# EasyEDA Pro project multi_port.eprj, schematic GL3520 US3.0集線器

## Sheets
1 main control: Board Name: Board1; Create Date: 2024-11-21; Page Name: main control; Project Name: multi_port; Schematic Name: GL3520 US3.0集線器; Update Date: 2025-04-09; Company: 嘉立创EDA; Page Size: A4; Version: V1.0
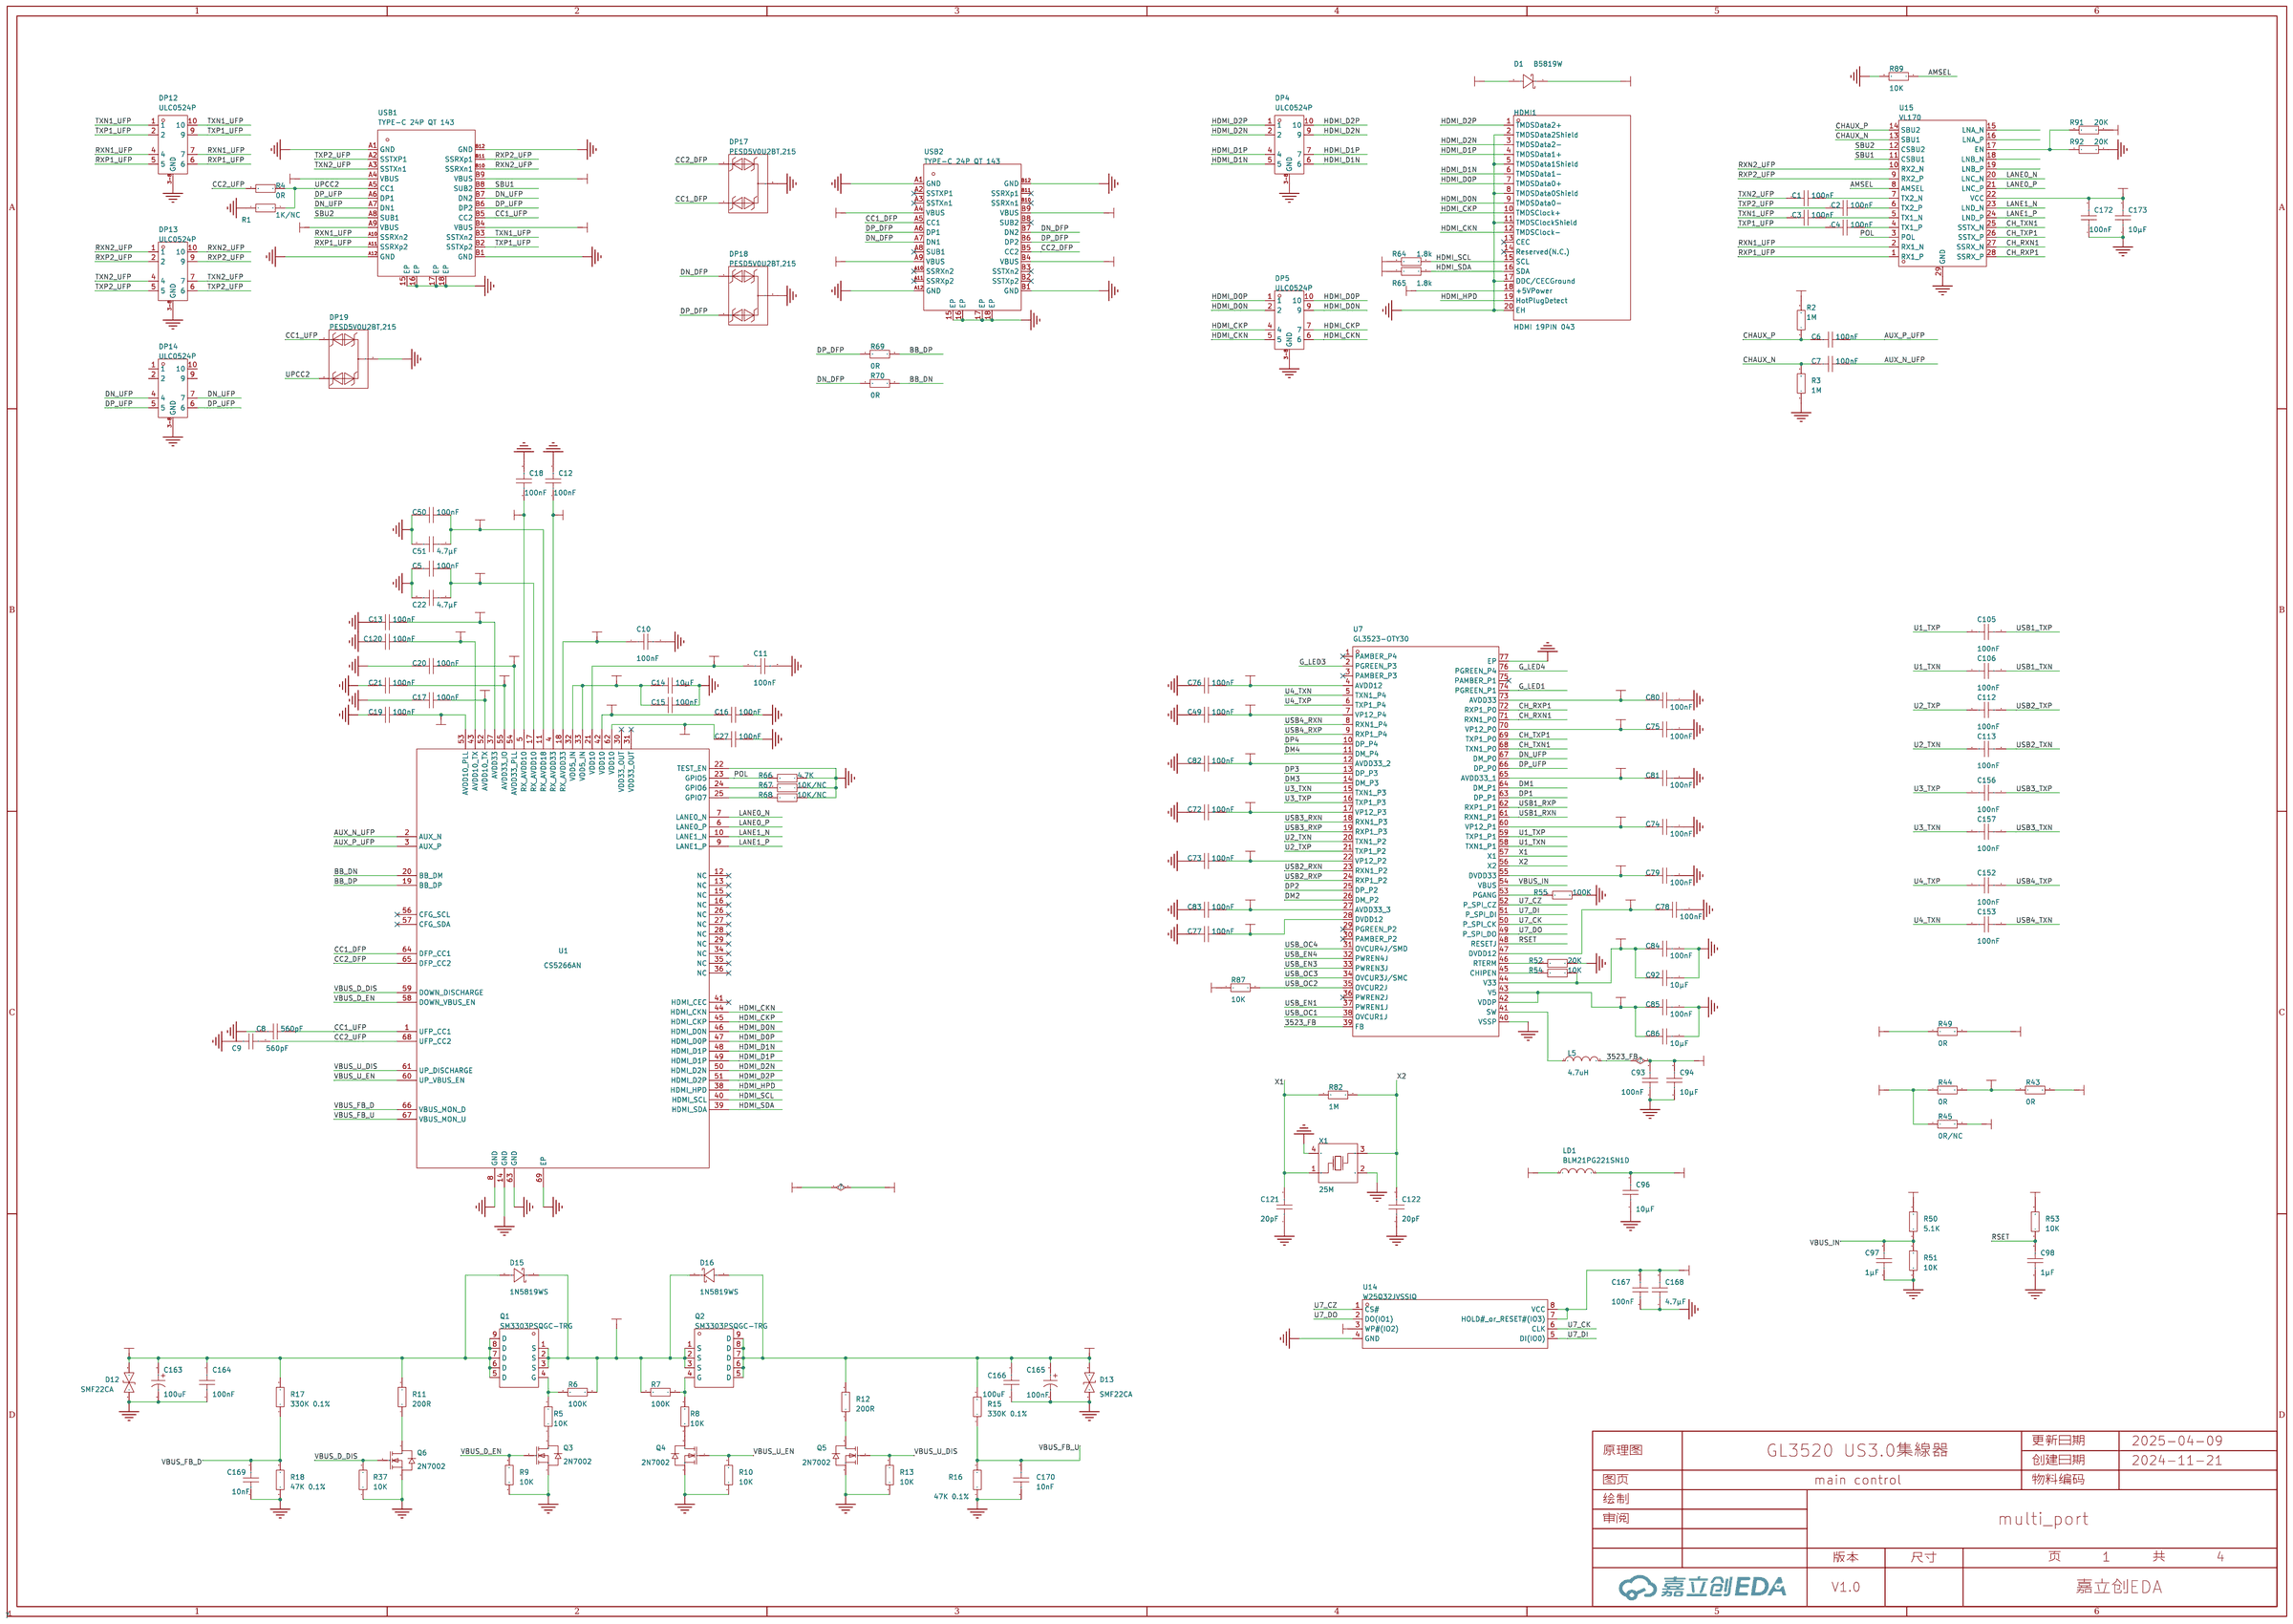
[diagram p0: main control]
2 Charging: Create Date: 2024-11-22; Page Name: Charging; Update Date: 2025-02-21
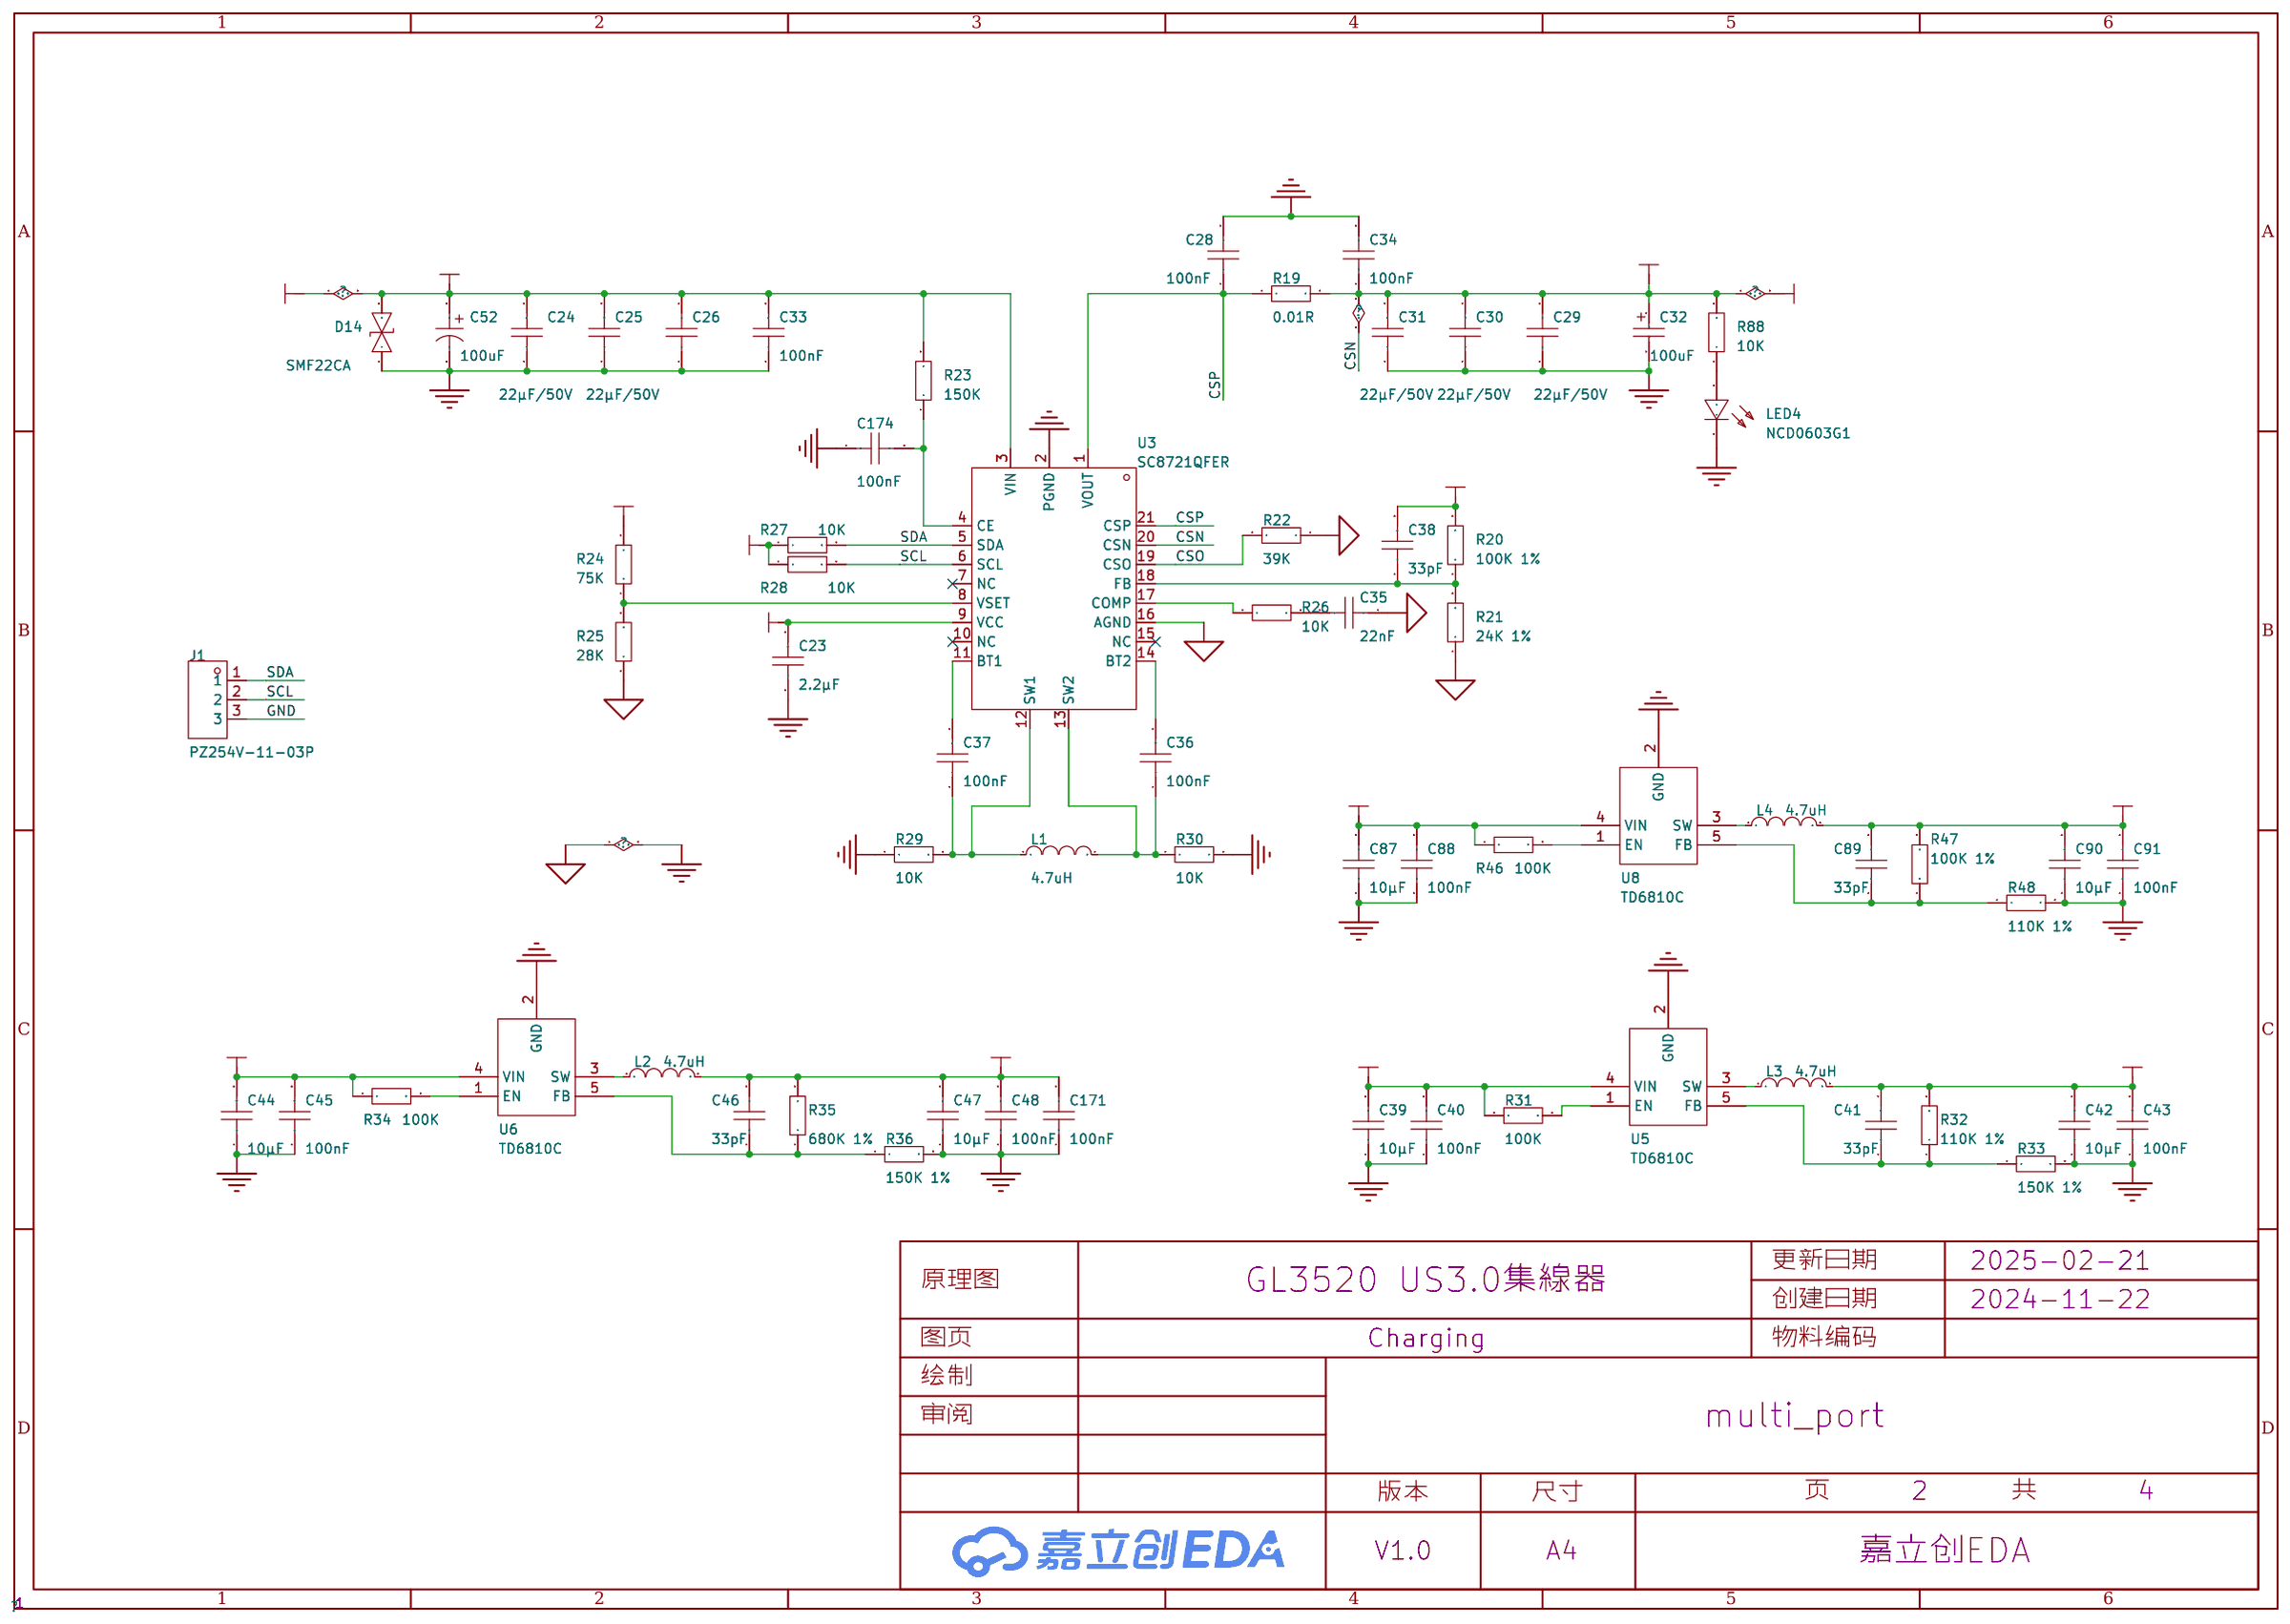
[diagram p1: Charging]
3 Port: Create Date: 2024-11-22; Page Name: Port; Update Date: 2025-02-20
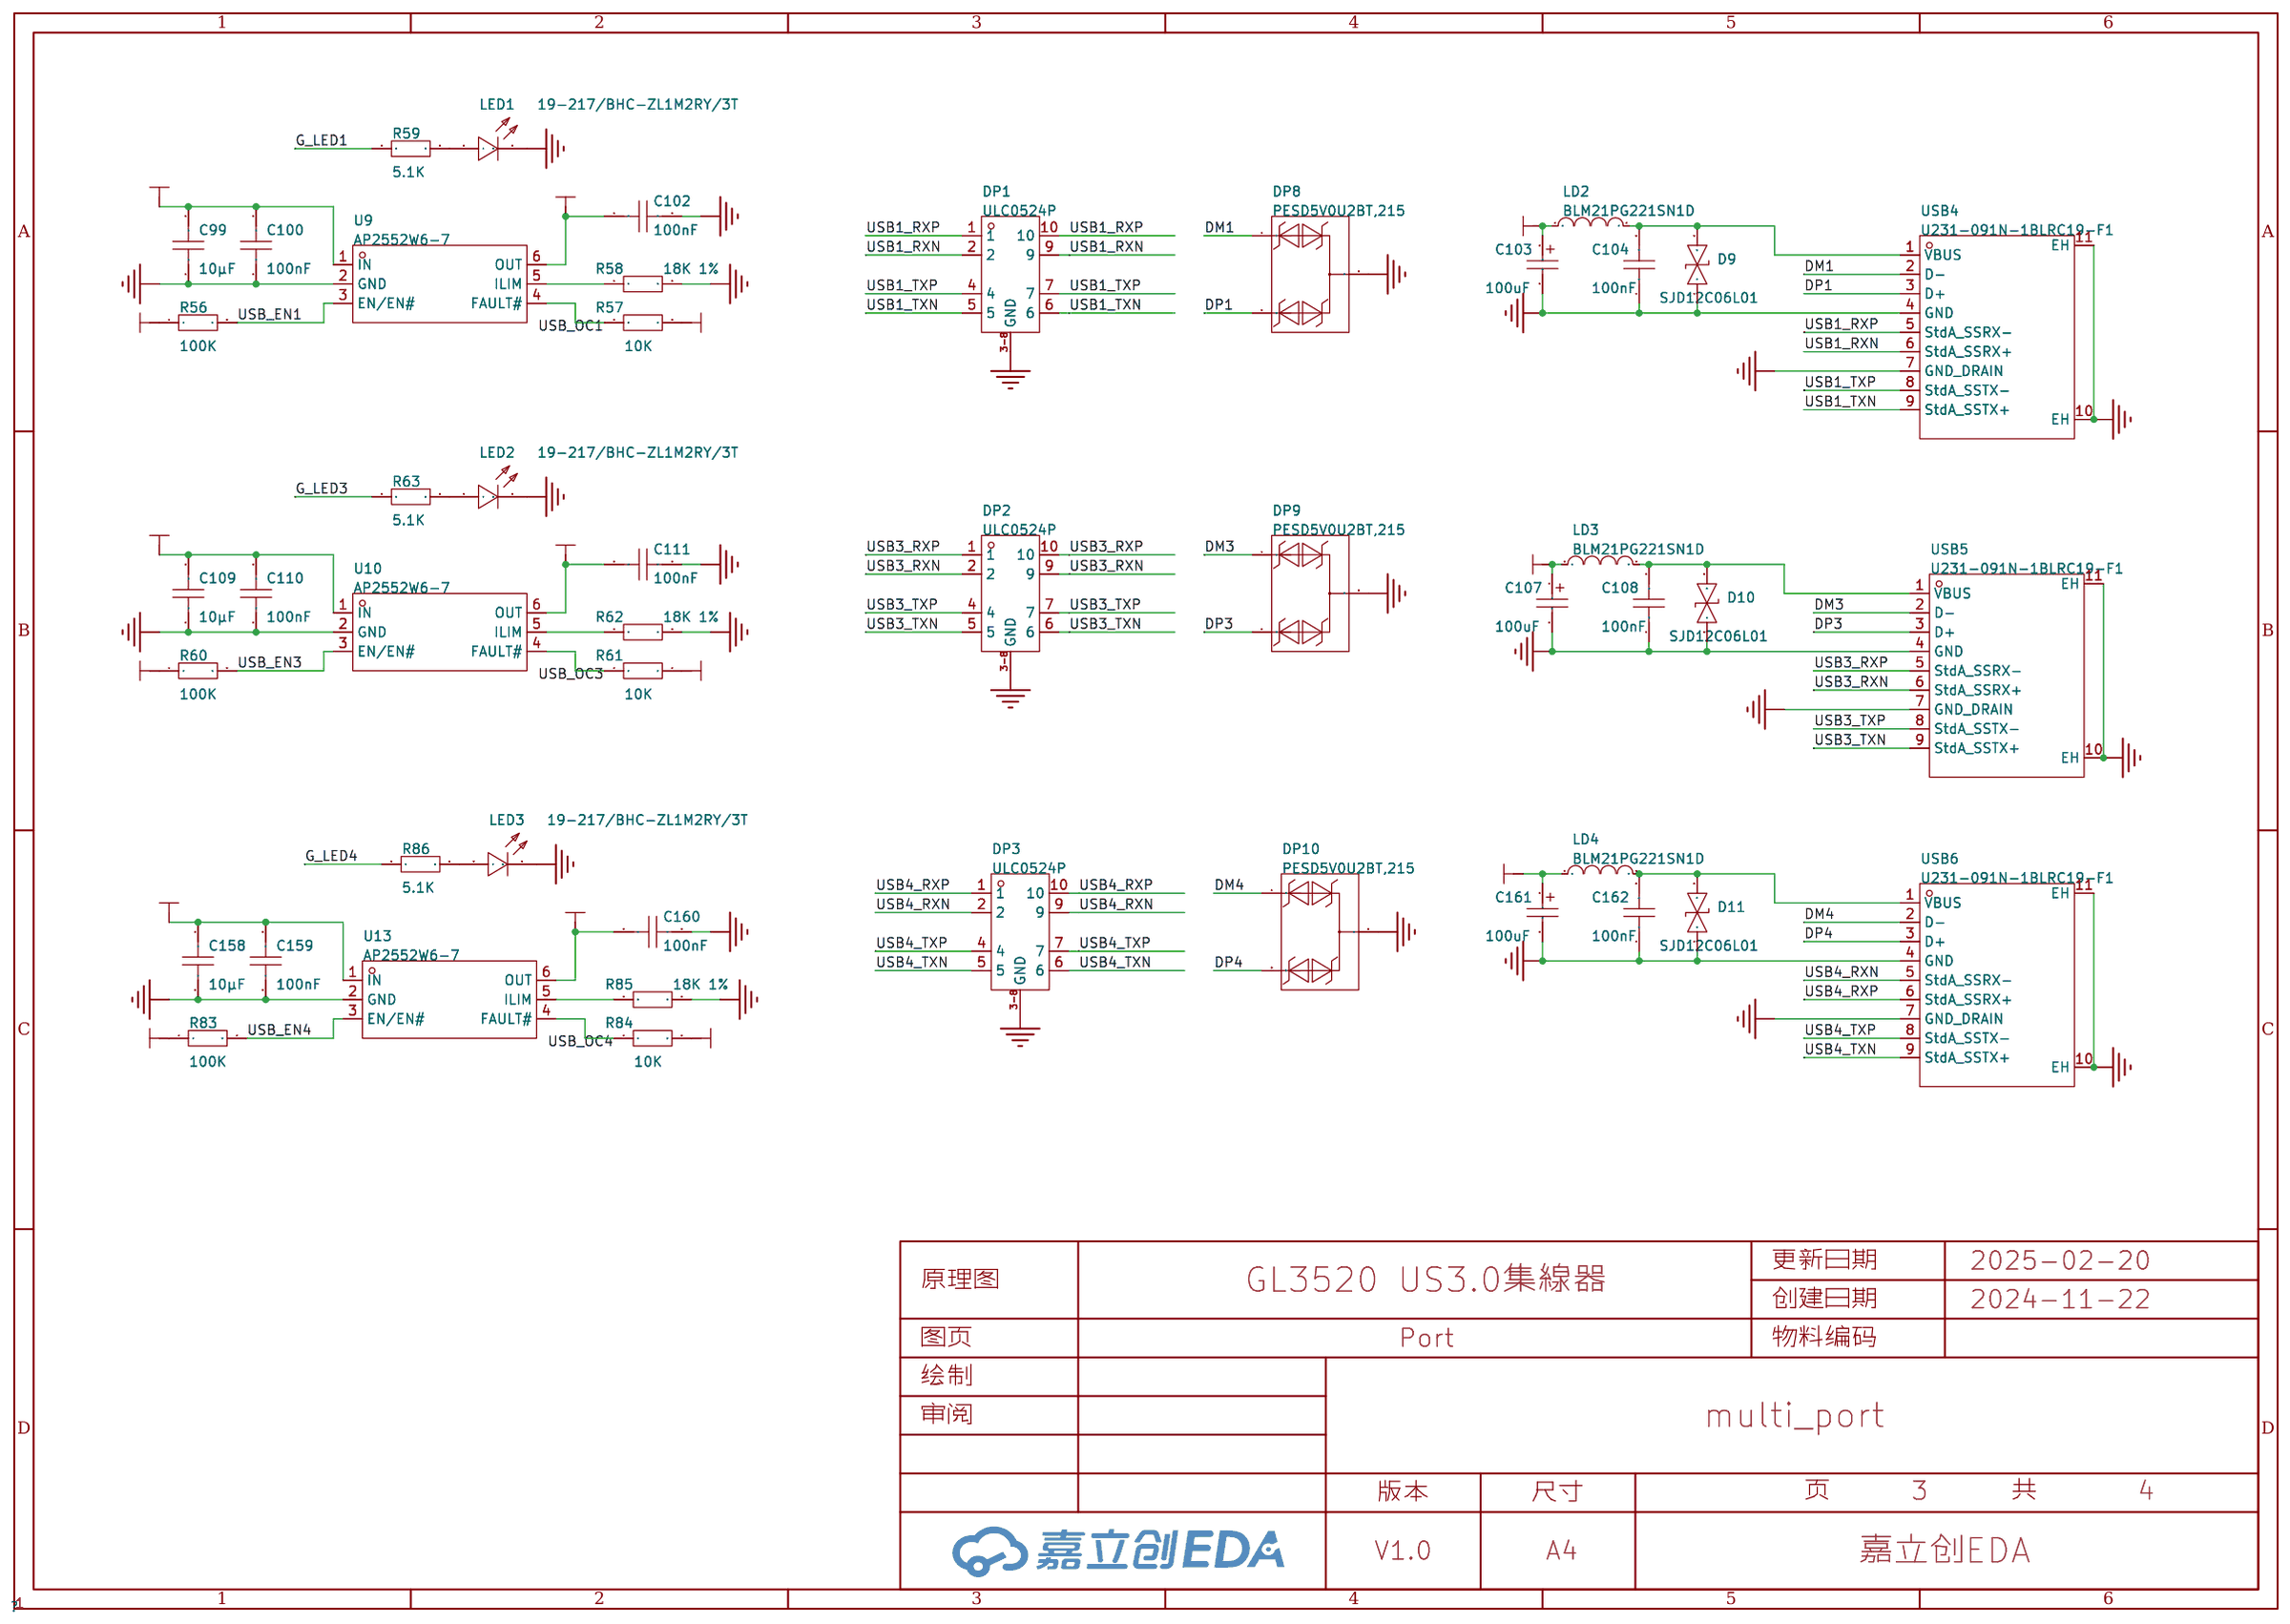
[diagram p2: Port]
4 Internet: Create Date: 2024-11-22; Page Name: Internet; Update Date: 2025-02-21
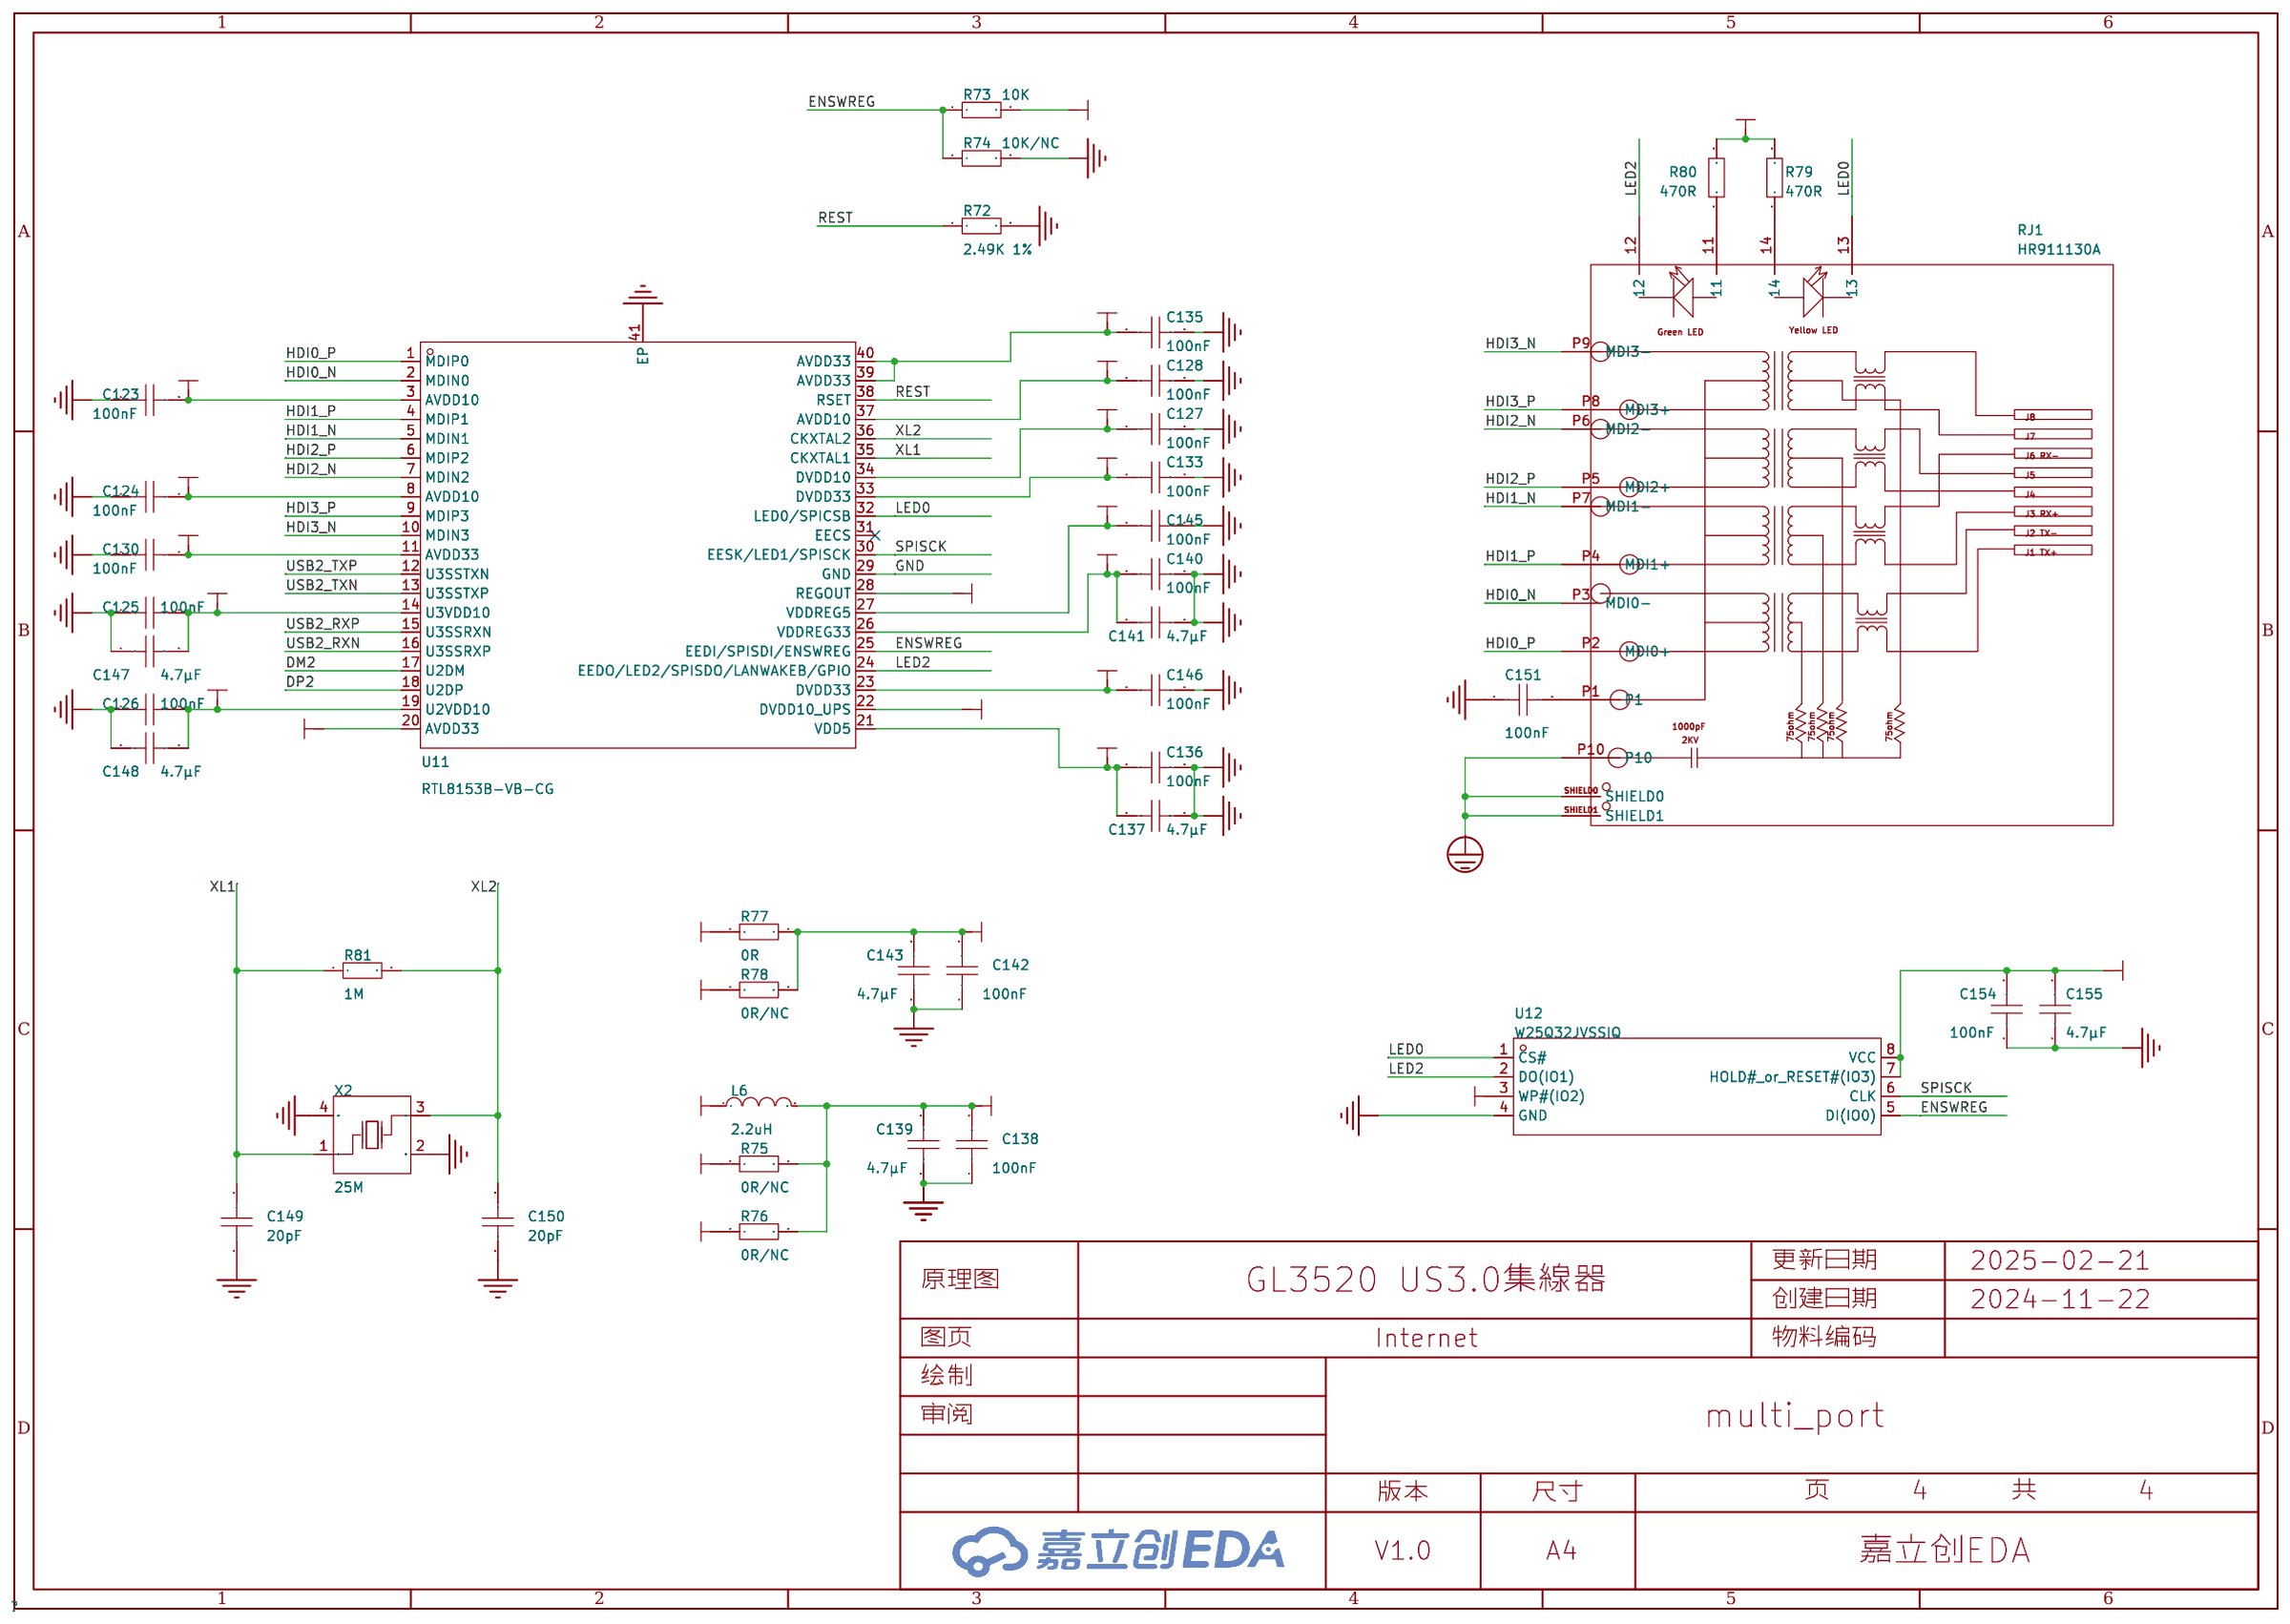
[diagram p3: Internet]

## Parts
sheet Charging
C23  2.2μF  [C0603]
C24  22μF/50V  [C0805]
C25  22μF/50V  [C0805]
C26  100nF  [C0805]
C28  100nF  [C0603]
C29  22μF/50V  [C0805]
C30  22μF/50V  [C0805]
C31  22μF/50V  [C0805]
C32  100uF  [CASE-B_3528]
C33  100nF  [C0603]
C34  100nF  [C0603]
C35  22nF  [C0603]
C36  100nF  [C0603]
C37  100nF  [C0603]
C38  33pF  [C0603]
C39  10μF  [C0603]
C40  100nF  [C0603]
C41  33pF  [C0603]
C42  10μF  [C0603]
C43  100nF  [C0603]
C44  10μF  [C0603]
C45  100nF  [C0603]
C46  33pF  [C0603]
C47  10μF  [C0603]
C48  100nF  [C0603]
C52  100uF  [CAP-TH_BD6.0-P2.50-D0.5-FD]
C87  10μF  [C0603]
C88  100nF  [C0603]
C89  33pF  [C0603]
C90  10μF  [C0603]
C91  100nF  [C0603]
C171  100nF  [C0603]
C174  100nF  [C0603]
D14  SMF22CA  [SOD-123FL_L2.8-W1.8-LS3.7-BI]
J1  PZ254V-11-03P  [HDR-TH_3P-P2.54-V-M]
L1  4.7uH  [IND-SMD_L7.3-W6.6]
L2  4.7uH  [IND-SMD_L4.0-W4.0]
L3  4.7uH  [IND-SMD_L4.0-W4.0]
L4  4.7uH  [IND-SMD_L4.0-W4.0]
LED4  NCD0603G1  [LED0603-RD_1]
R19  0.01R  [R1206]
R20  100K 1%  [R0603]
R21  24K 1%  [R0603]
R22  39K  [R0603]
R23  150K  [R0603]
R24  75K  [R0603]
R25  28K  [R0603]
R26  10K  [R0603]
R27  10K  [R0603]
R28  10K  [R0603]
R29  10K  [R0603]
R30  10K  [R0603]
R31  100K  [R0603]
R32  110K 1%  [R0603]
R33  150K 1%  [R0603]
R34  100K  [R0603]
R35  680K 1%  [R0603]
R36  150K 1%  [R0603]
R46  100K  [R0603]
R47  100K 1%  [R0603]
R48  110K 1%  [R0603]
R88  10K  [R0603]
U3  SC8721QFER  [QFN-21_L4.0-W4.0-P0.40-BL_SC8721QFER]
U5  TD6810C  [SOT-23-5_L3.0-W1.7-P0.95-LS2.8-BR]
U6  TD6810C  [SOT-23-5_L3.0-W1.7-P0.95-LS2.8-BR]
U8  TD6810C  [SOT-23-5_L3.0-W1.7-P0.95-LS2.8-BR]
sheet Internet
C123  100nF  [C0603]
C124  100nF  [C0603]
C125  100nF  [C0603]
C126  100nF  [C0603]
C127  100nF  [C0603]
C128  100nF  [C0603]
C130  100nF  [C0603]
C133  100nF  [C0603]
C135  100nF  [C0603]
C136  100nF  [C0603]
C137  4.7μF  [C0603]
C138  100nF  [C0603]
C139  4.7μF  [C0603]
C140  100nF  [C0603]
C141  4.7μF  [C0603]
C142  100nF  [C0603]
C143  4.7μF  [C0603]
C145  100nF  [C0603]
C146  100nF  [C0603]
C147  4.7μF  [C0603]
C148  4.7μF  [C0603]
C149  20pF  [C0603]
C150  20pF  [C0603]
C151  100nF  [C0603]
C154  100nF  [C0603]
C155  4.7μF  [C0603]
L6  2.2uH  [IND-SMD_L2.5-W2.0-VLS252012CX-150M]
R72  2.49K 1%  [R0603]
R73  10K  [R0603]
R74  10K/NC  [R0603]
R75  0R/NC  [R0805]
R76  0R/NC  [R0805]
R77  0R  [R0805]
R78  0R/NC  [R0805]
R79  470R  [R0603]
R80  470R  [R0603]
R81  1M  [R0603]
RJ1  HR911130A  [RJ45-TH_HR911130A]
U11  RTL8153B-VB-CG  [QFN-40_L5.0-W5.0-P0.40-BL-EP3.7]
U12  W25Q32JVSSIQ  [SOIC-8_L5.3-W5.3-P1.27-LS8.0-BL]
X2  25M  [CRYSTAL-SMD_4P-L2.0-W1.6-BL]
sheet main control
C1  100nF  [C0603]
C2  100nF  [C0603]
C3  100nF  [C0603]
C4  100nF  [C0603]
C5  100nF  [C0603]
C6  100nF  [C0603]
C7  100nF  [C0603]
C8  560pF  [C0603]
C9  560pF  [C0603]
C10  100nF  [C0603]
C11  100nF  [C0603]
C12  100nF  [C0603]
C13  100nF  [C0603]
C14  10μF  [C0603]
C15  100nF  [C0603]
C16  100nF  [C0603]
C17  100nF  [C0603]
C18  100nF  [C0603]
C19  100nF  [C0603]
C20  100nF  [C0603]
C21  100nF  [C0603]
C22  4.7μF  [C0603]
C27  100nF  [C0603]
C49  100nF  [C0603]
C50  100nF  [C0603]
C51  4.7μF  [C0603]
C72  100nF  [C0603]
C73  100nF  [C0603]
C74  100nF  [C0603]
C75  100nF  [C0603]
C76  100nF  [C0603]
C77  100nF  [C0603]
C78  100nF  [C0603]
C79  100nF  [C0603]
C80  100nF  [C0603]
C81  100nF  [C0603]
C82  100nF  [C0603]
C83  100nF  [C0603]
C84  100nF  [C0603]
C85  100nF  [C0603]
C86  10μF  [C0603]
C92  10μF  [C0603]
C93  100nF  [C0603]
C94  10μF  [C0603]
C96  10μF  [C0603]
C97  1μF  [C0603]
C98  1μF  [C0603]
C105  100nF  [C0603]
C106  100nF  [C0603]
C112  100nF  [C0603]
C113  100nF  [C0603]
C120  100nF  [C0603]
C121  20pF  [C0603]
C122  20pF  [C0603]
C152  100nF  [C0603]
C153  100nF  [C0603]
C156  100nF  [C0603]
C157  100nF  [C0603]
C163  100uF  [CAP-TH_BD6.3-P2.50-D1.0-FD]
C164  100nF  [C0603]
C165  100uF  [CAP-TH_BD6.3-P2.50-D1.0-FD]
C166  100nF  [C0603]
C167  100nF  [C0603]
C168  4.7μF  [C0603]
C169  10nF  [C0603]
C170  10nF  [C0603]
C172  100nF  [C0603]
C173  10μF  [C0603]
D1  B5819W  [SOD-123F_L2.7-W1.6-LS3.8-RD-1]
D12  SMF22CA  [SOD-123FL_L2.8-W1.8-LS3.7-BI]
D13  SMF22CA  [SOD-123FL_L2.8-W1.8-LS3.7-BI]
D15  1N5819WS  [SOD-323_L1.6-W1.3-LS2.6-RD-1]
D16  1N5819WS  [SOD-323_L1.6-W1.3-LS2.6-RD-1]
DP4  ULC0524P  [DSON-10_L2.5-W1.0-P0.50-BL]
DP5  ULC0524P  [DSON-10_L2.5-W1.0-P0.50-BL]
DP12  ULC0524P  [DSON-10_L2.5-W1.0-P0.50-BL]
DP13  ULC0524P  [DSON-10_L2.5-W1.0-P0.50-BL]
DP14  ULC0524P  [DSON-10_L2.5-W1.0-P0.50-BL]
DP17  PESD5V0U2BT,215  [SOT-23-3_L2.9-W1.6-P1.90-LS2.8-BR]
DP18  PESD5V0U2BT,215  [SOT-23-3_L2.9-W1.6-P1.90-LS2.8-BR]
DP19  PESD5V0U2BT,215  [SOT-23-3_L2.9-W1.6-P1.90-LS2.8-BR]
HDMI1  HDMI 19PIN 043  [HDMI-SMD_HDMI-19PIN-043]
L5  4.7uH  [IND-SMD_L4.0-W4.0]
LD1  BLM21PG221SN1D  [L0805]
Q1  SM3303PSQGC-TRG  [WDFN-8_L3.0-W3.0-P0.65-BL]
Q2  SM3303PSQGC-TRG  [WDFN-8_L3.0-W3.0-P0.65-BL]
Q3  2N7002  [SOT-23-3_L2.9-W1.3-P1.90-LS2.4-BR]
Q4  2N7002  [SOT-23-3_L2.9-W1.3-P1.90-LS2.4-BR]
Q5  2N7002  [SOT-23-3_L2.9-W1.3-P1.90-LS2.4-BR]
Q6  2N7002  [SOT-23-3_L2.9-W1.3-P1.90-LS2.4-BR]
R1  1K/NC  [R0603]
R2  1M  [R0603]
R3  1M  [R0603]
R4  0R  [R0603]
R5  10K  [R0603]
R6  100K  [R0603]
R7  100K  [R0603]
R8  10K  [R0603]
R9  10K  [R0603]
R10  10K  [R0603]
R11  200R  [R0805]
R12  200R  [R0805]
R13  10K  [R0603]
R15  330K 0.1%  [R0603]
R16  47K 0.1%  [R0603]
R17  330K 0.1%  [R0603]
R18  47K 0.1%  [R0603]
R37  10K  [R0603]
R43  0R  [R0805]
R44  0R  [R0805]
R45  0R/NC  [R0805]
R49  0R  [R0805]
R50  5.1K  [R0603]
R51  10K  [R0603]
R52  20K  [R0603]
R53  10K  [R0603]
R54  10K  [R0603]
R55  100K  [R0603]
R64  1.8k  [R0603]
R65  1.8k  [R0603]
R66  4.7K  [R0603]
R67  10K/NC  [R0603]
R68  10K/NC  [R0603]
R69  0R  [R0603]
R70  0R  [R0603]
R82  1M  [R0603]
R87  10K  [R0603]
R89  10K  [R0603]
R91  20K  [R0603]
R92  20K  [R0603]
U1  CS5266AN  [QFN-68_L8.0-W8.0-P0.40-TL-EP5.7]
U7  GL3523-OTY30  [QFN-76_L9.0-W9.0-P0.40-BL-EP]
U14  W25Q32JVSSIQ  [SOIC-8_L5.3-W5.3-P1.27-LS8.0-BL]
U15  VL170  [MQFN-28_L4.5-W3.5-P0.40-BL-EP]
USB1  TYPE-C 24P QT 143  [TYPE-C-SMD_C9900025773]
USB2  TYPE-C 24P QT 143  [TYPE-C-SMD_C9900025773]
X1  25M  [CRYSTAL-SMD_4P-L2.0-W1.6-BL]
sheet Port
C99  10μF  [C0603]
C100  100nF  [C0603]
C102  100nF  [C0603]
C103  100uF  [CASE-B_3528]
C104  100nF  [C0603]
C107  100uF  [CASE-B_3528]
C108  100nF  [C0603]
C109  10μF  [C0603]
C110  100nF  [C0603]
C111  100nF  [C0603]
C158  10μF  [C0603]
C159  100nF  [C0603]
C160  100nF  [C0603]
C161  100uF  [CASE-B_3528]
C162  100nF  [C0603]
D9  SJD12C06L01  [SOD-123_L2.8-W1.8-LS3.7-BI]
D10  SJD12C06L01  [SOD-123_L2.8-W1.8-LS3.7-BI]
D11  SJD12C06L01  [SOD-123_L2.8-W1.8-LS3.7-BI]
DP1  ULC0524P  [DSON-10_L2.5-W1.0-P0.50-BL]
DP2  ULC0524P  [DSON-10_L2.5-W1.0-P0.50-BL]
DP3  ULC0524P  [DSON-10_L2.5-W1.0-P0.50-BL]
DP8  PESD5V0U2BT,215  [SOT-23-3_L2.9-W1.6-P1.90-LS2.8-BR]
DP9  PESD5V0U2BT,215  [SOT-23-3_L2.9-W1.6-P1.90-LS2.8-BR]
DP10  PESD5V0U2BT,215  [SOT-23-3_L2.9-W1.6-P1.90-LS2.8-BR]
LD2  BLM21PG221SN1D  [L0805]
LD3  BLM21PG221SN1D  [L0805]
LD4  BLM21PG221SN1D  [L0805]
LED1  19-217/BHC-ZL1M2RY/3T  [LED0603-FD_BLUE]
LED2  19-217/BHC-ZL1M2RY/3T  [LED0603-FD_BLUE]
LED3  19-217/BHC-ZL1M2RY/3T  [LED0603-FD_BLUE]
R56  100K  [R0603]
R57  10K  [R0603]
R58  18K 1%  [R0603]
R59  5.1K  [R0603]
R60  100K  [R0603]
R61  10K  [R0603]
R62  18K 1%  [R0603]
R63  5.1K  [R0603]
R83  100K  [R0603]
R84  10K  [R0603]
R85  18K 1%  [R0603]
R86  5.1K  [R0603]
U9  AP2552W6-7  [SOT-26_L3.0-W1.6-P0.95-LS2.8-BL]
U10  AP2552W6-7  [SOT-26_L3.0-W1.6-P0.95-LS2.8-BL]
U13  AP2552W6-7  [SOT-26_L3.0-W1.6-P0.95-LS2.8-BL]
USB4  U231-091N-1BLRC19-F1  [USB-3.0-TH_XKB_U231-091N-1BLRC19-F1]
USB5  U231-091N-1BLRC19-F1  [USB-3.0-TH_XKB_U231-091N-1BLRC19-F1]
USB6  U231-091N-1BLRC19-F1  [USB-3.0-TH_XKB_U231-091N-1BLRC19-F1]

## Library data of the parts
C1-C25 C27-C31 C33-C51 C72-C94 C96-C100 C102 C104-C106 C108-C113 C120-C128 C130 C133 C135-C143 C145-C160 C162 C164 C166-C174 = CAP_0603: Supplier Footprint: 0603
C26 = CAP_0805: Supplier Footprint: 0805
C32 = TAJB107K006RNJ: LCSC Part Name: 100uF ±10% 6.3V; Supplier Part: C16133; Manufacturer: Kyocera AVX; Supplier Footprint: CASE-B-3528-21(mm); JLCPCB Part Class: Basic Part; Datasheet: https://atta.szlcsc.com/upload/public/pdf/source/20160107/1457707750344.pdf; Supplier: LCSC; Tolerance: ±10%; Rated Voltage: 6.3V; Equivalent Series Resistance(ESR): 1.7Ω@100kHz; Operating Temperature: -55℃~+125℃
C52 = 35V100uF CD288: LCSC Part Name: 100uF ±20% 35V; Supplier Part: C2960219; Manufacturer: HRK(鸿瑞凯电子); Supplier Footprint: 插件,D6.3xL7mm; JLCPCB Part Class: Extended Part; Datasheet: https://atta.szlcsc.com/upload/public/pdf/source/20220224/25376043BEABA817BBA4B7CAB7E6DE1E.pdf; Supplier: LCSC; Tolerance: ±20%; Rated Voltage: 35V; Lead Spacing: 2.5mm; φD: 6.3mm; L: 7mm; Operating Temperature: -40℃~+105℃
D12-D14 = SMF22CA_C353295: Supplier Part: C353295; Manufacturer: 晶导微电子; Supplier Footprint: SOD-123FL; JLCPCB Part Class: Extended Part; Datasheet: https://atta.szlcsc.com/upload/public/pdf/source/20201106/C438024_76561727B84E8C9F41A4B4461A8AA838.pdf; Supplier: LCSC; Reverse Stand-Off Voltage (Vrwm): 22V; Maximum Clamping Voltage: 35.5V; Peak Pulse Current (Ipp)@10/1000us: 5.6A; Breakdown Voltage: 24.4V; Reverse Leakage Current (Ir): 1uA; Type: TVS
J1 = PZ254V-11-03P: LCSC Part Name: 间距:2.54mm 1x3P 直插 方针; Supplier Part: C2937625; Manufacturer: XFCN(兴飞); Supplier Footprint: 插件,P=2.54mm; JLCPCB Part Class: 扩展库; Datasheet: https://atta.szlcsc.com/upload/public/pdf/source/20200309/C492402_8335C3D49C4E4C618838D59BB1D024C1.pdf; Supplier: LCSC; Pin Structure: 1x3P; Pitch: 2.54mm; Circluar Pins/Square Pins: 方针; Mounting Type: 直插; Number of Rows: 单排; Number of Pins: 3P; Current Rating (Max): 3A; Voltage Rating (Max): 250V; Length of Mating Pin: 6mm; Insulation Height: 2.5mm; Length of End Connection Pin: 3mm; Operating Temperature Range: -40℃~+105℃; Color: 黑色
L1 = GSSM06304R7M2AU: LCSC Part Name: 4.7uH ±20% 10A; Supplier Part: C2928306; Manufacturer: ABC(千如); Supplier Footprint: SMD,6.6x7.3mm; JLCPCB Part Class: Extended Part; Datasheet: https://atta.szlcsc.com/upload/public/pdf/source/20211208/D33E2A1589C7A5FA690CD07A57271819.pdf; Supplier: LCSC; Tolerance: ±20%; Rated Current: 10A; Saturation Current (Isat): 10A; DC Resistance (DCR): 37mΩ
L2-L5 = SWPA4030S4R7MT: LCSC Part Name: 4.7uH ±20% 3.2A; Supplier Part: C57269; Manufacturer: Sunlord(顺络); Supplier Footprint: SMD,4x4mm; JLCPCB Part Class: Extended Part; Datasheet: https://atta.szlcsc.com/upload/public/pdf/source/20231024/317626D2AA2F8AB4113C1875E432E6E1.pdf; Supplier: LCSC; Tolerance: ±20%; Rated Current: 2A; Saturation Current (Isat): 3.2A; DC Resistance (DCR): 78mΩ
LED4 = NCD0603G1: Supplier Part: C84267; Manufacturer: 国星光电; Supplier Footprint: 0603; Datasheet: https://atta.szlcsc.com/upload/public/pdf/source/20200820/C84267_04BA7703640BAC111D09F5EFB971FBF3.pdf; Supplier: LCSC; Emitted Color: 翠绿色; Forward Voltage (VF): 2.6V~3.6V; Power Dissipation: 72mW; Forward Current: 10mA; Dominant Wavelength: 515nm~530nm; Lens Color: 无色透明透镜; Luminous Intensity: 330mcd~900mcd; Viewing Angle: 130°; Operating Temperature: -30℃~+85℃
R1-R10 R12 R13 R15-R17 R19-R37 R45-R70 R72-R89 R91 R92 = Res_0603: Supplier Footprint: 0603
U3 = SC8721QFER: Supplier Part: C429907; Manufacturer: SOUTHCHIP(南芯); Supplier Footprint: QFN-21(4x4); JLCPCB Part Class: 扩展库; Datasheet: https://atta.szlcsc.com/upload/public/pdf/source/20190920/C429907_D6CD4B988C6DA1964AADC51C5C4E505F.pdf; Supplier: LCSC
U5 U6 U8 = TD6810C: 功能类型:降压型;输入电压:2.5V~6.5V;输出电流:1.5A;; LCSC Part Name: DC-DC芯片; Supplier Part: C1884587; Manufacturer: Techcode(泰德); Supplier Footprint: SOT-23-5; JLCPCB Part Class: 扩展库; Datasheet: https://atta.szlcsc.com/upload/public/pdf/source/20210104/C1884587_758614A07123AB5D7D481634B0653658.pdf; Supplier: LCSC; Function: 降压型; Input Voltage: 2.5V~6.5V; Output Current: 1.5A; Switching Frequency: 1.5MHz; Operating Temperature: -40℃~+85℃; Synchronous Rectification: 是; Number of Outputs: 1; Switch tube (built-in/external): 内置
L6 = VLS252012CX-2R2M: LCSC Part Name: 2.2uH ±20% 停产; Supplier Part: C307867; Manufacturer: TDK; Supplier Footprint: 2520; JLCPCB Part Class: Extended Part; Datasheet: https://atta.szlcsc.com/upload/public/pdf/source/20200727/C307867_825634F56BDB10F5BF665C183AF56530.pdf; Supplier: LCSC; Tolerance: ±20%; Rated Current: 1.76A; DC Resistance (DCR): 80mΩ
RJ1 = HR911130A: LCSC Part Name: 带LED; Supplier Part: C54408; Manufacturer: HANRUN(汉仁); Supplier Footprint: 插件; Datasheet: https://atta.szlcsc.com/upload/public/pdf/source/20151014/1457707458393.pdf; Supplier: LCSC; Connector Type: RJ45插座; Number of Ports: 1; LED: 带LED
U11 = RTL8153B-VB-CG: LCSC Part Name: 适用于USB 3.0 集成10/100/1000M以太网控制器; Supplier Part: C2802072; Manufacturer: REALTEK(瑞昱); Supplier Footprint: QFN-40-EP(5x5); Datasheet: https://atta.szlcsc.com/upload/public/pdf/source/20220614/B5E31E0CB1F66CB9DAE335D144E02EAB.pdf; Supplier: LCSC
U12 U14 = W25Q32JVSSIQ: Supplier Part: C179173; Manufacturer: WINBOND(华邦); Supplier Footprint: SOIC-8-208mil; Datasheet: https://atta.szlcsc.com/upload/public/pdf/source/20191218/C179173_5BBD793D2D7B3672E140BC7AE85C11FF.pdf; Supplier: LCSC
X1 X2 = NX2016SA-25MHZ-STD-CZS-2: LCSC Part Name: NX2016SA 25MHz 8pF ±15ppm; Supplier Part: C843258; Manufacturer: NDK; Supplier Footprint: SMD2016-4P; JLCPCB Part Class: Extended Part; Datasheet: https://atta.szlcsc.com/upload/public/pdf/source/20201009/C843258_4E8DF2193DBAD12E5B49025E564DBC2F.pdf; Supplier: LCSC
C163 C165 = GR107M050E12RR0VH4FP0: LCSC Part Name: 100uF ±20% 50V 黑; Supplier Part: C47891; Manufacturer: CX(承兴); Supplier Footprint: 插件,D6.3xL12mm; JLCPCB Part Class: Extended Part; Datasheet: https://atta.szlcsc.com/upload/public/pdf/source/20211027/ED0DA65C69F42D9BDEC91091BA4C03CD.pdf; Supplier: LCSC; Tolerance: ±20%; Rated Voltage: 50V; Lead Spacing: 2.5mm; φD: 6.3mm; L: 12mm; Lifetime @ Temp: 2000hrs@105℃; Operating Temperature: -40℃~+105℃
D1 = B5819W: LCSC Part Name: 电压:40V 电流:1A; Supplier Part: C2943878; Manufacturer: GOODWORK(固得沃克); Supplier Footprint: SOD-123; JLCPCB Part Class: 扩展库; Datasheet: https://atta.szlcsc.com/upload/public/pdf/source/20220114/81042131F39C8520B6390246D7392C1A.pdf; Supplier: LCSC; Forward Voltage (Vf@If): 580mV@1A; Reverse Voltage (Vr): 40V; Average Rectified Current (Io): 1A; Reverse Leakage Current (Ir): 50uA@40V
D15 D16 = 1N5819WS: LCSC Part Name: 电压:40V 电流:1A; Supplier Part: C2903903; Manufacturer: GOODWORK(固得沃克); Supplier Footprint: SOD-323; JLCPCB Part Class: 扩展库; Datasheet: https://atta.szlcsc.com/upload/public/pdf/source/20220114/BF6ECC8ED918A91A4FEA6F25B6F03A5F.pdf; Supplier: LCSC; Forward Voltage (Vf@If): 580mV@1A; Reverse Voltage (Vr): 40V; Rectified Current: 1A; Reverse Leakage Current (Ir): 50uA@40V
DP1-DP5 DP12-DP14 = ULC0524P: 反向截止电压(Vrwm):5V;最大钳位电压:25V;峰值脉冲电流(Ipp)@10/1000us:5A;击穿电压:6V;; LCSC Part Name: TVS 5V截止 5A峰值脉冲; Supplier Part: C384892; Manufacturer: Leiditech(雷卯电子); Supplier Footprint: DSON-10; JLCPCB Part Class: 扩展库; Datasheet: https://atta.szlcsc.com/upload/public/pdf/source/20190425/C384892_9FA48074B6253F888578BF1973A5C10A.pdf; Supplier: LCSC; Reverse Stand-Off Voltage (Vrwm): 5V; Maximum Clamping Voltage: 25V; Peak Pulse Current (Ipp)@10/1000us: 5A; Breakdown Voltage: 6V; Type: TVS
DP8-DP10 DP17-DP19 = PESD5V0U2BT,215: 极性:双向;反向截止电压(Vrwm):5V;击穿电压:5.5V;; LCSC Part Name: 双向ESD; Supplier Part: C85399; Manufacturer: Nexperia(安世); Supplier Footprint: SOT-23; JLCPCB Part Class: 扩展库; Datasheet: https://atta.szlcsc.com/upload/public/pdf/source/20171113/C85399_15105616491421116133.pdf; Supplier: LCSC; polarity: 双向; Reverse Stand-Off Voltage (Vrwm): 5V; Breakdown Voltage: 5.5V; Number of Lines: 双路; Operating Temperature: -65℃~+150℃@(Ta); Type: ESD
HDMI1 = HDMI 19PIN 043: Supplier Part: C2858275; Manufacturer: SHOU HAN(首韩); Supplier Footprint: SMD; Datasheet: https://atta.szlcsc.com/upload/public/pdf/source/20210728/C2858275_DF299413048A9CF092C2A61AB97004F4.pdf; Supplier: LCSC
LD1-LD4 = BLM21PG221SN1D: LCSC Part Name: 单路 0805磁珠 阻抗220Ω@100MHz; Supplier Part: C85840; Manufacturer: muRata(村田); Supplier Footprint: 0805; JLCPCB Part Class: 扩展库; Datasheet: https://atta.szlcsc.com/upload/public/pdf/source/20180326/C118443_3FAC30E9A4F0E6B81275543C61E0685E.pdf; Supplier: LCSC; Impedance @ Frequency: 220Ω@100MHz; Tolerance: ±25%; DC Resistance: 45mΩ; Current Rating: 2A; Circuits: 1
Q1 Q2 = SM3303PSQGC-TRG: LCSC Part Name: 1个P沟道 耐压:30V 电流:50A; Supplier Part: C207600; Manufacturer: Sinopower(大中); Supplier Footprint: WDFN-8(3x3); JLCPCB Part Class: 扩展库; Datasheet: https://atta.szlcsc.com/upload/public/pdf/source/20200623/C207600_BE008E5BDECBD06E88D6264FAEA4868D.pdf; Supplier: LCSC; Type: 1个P沟道; Drain Source Voltage (Vdss): 30V; Continuous Drain Current (Id): 50A; Power Dissipation (Pd): 35.7W; Drain Source On Resistance (RDS(on)@Vgs,Id): 7.5mΩ@10V,17.1A; Gate Threshold Voltage (Vgs(th)@Id): 1.8V@250uA; Total Gate Charge (Qg@Vgs): 45nC@10V; Input Capacitance (Ciss@Vds): 2.11nF@15V; Reverse Transfer Capacitance (Crss@Vds): 330pF@15V
Q3-Q6 = 2N7002: LCSC Part Name: 1个N沟道 耐压:60V 电流:115mA; Supplier Part: C727149; Manufacturer: TWGMC(台湾迪嘉); Supplier Footprint: SOT-23; JLCPCB Part Class: 扩展库; Datasheet: https://atta.szlcsc.com/upload/public/pdf/source/20200827/C727149_F88DE2A79720D5B1ACE833184507B038.pdf; Supplier: LCSC; Type: 1个N沟道; Drain Source Voltage (Vdss): 60V; Continuous Drain Current (Id): 115mA; Drain Source On Resistance (RDS(on)@Vgs,Id): 7.5Ω@10V,500mA; Power Dissipation (Pd): 200mW; Gate Threshold Voltage (Vgs(th)@Id): 2.5V@250uA; Input Capacitance (Ciss@Vds): 50pF@25V; Reverse Transfer Capacitance (Crss@Vds): 5pF@25V; Operating Temperature: -55℃~+150℃
R11 R18 = Res_AXIAL-1/8W: Supplier Footprint: 轴向引线
R43 R44 = Res_0805: Supplier Footprint: 0805
U1 = CS5266AN: Supplier Part: C9900040338; Supplier Footprint: QFN-68_8X8; JLCPCB Part Class: 扩展库; Supplier: LCSC
U7 = GL3523-OTY30: 应用功能:-;接口协议:-;; Supplier Part: C390630; Manufacturer: GENESYS(创惟); Supplier Footprint: QFN-76-EP(9x9); JLCPCB Part Class: 扩展库; Datasheet: https://atta.szlcsc.com/upload/public/pdf/source/20190529/C390630_BF19E681E45EDC73D3FAA05E275250BB.pdf; Supplier: LCSC
U15 = VL170: Supplier Part: C2940040; Supplier Footprint: MQFN-28-EP(3.5x4.5); JLCPCB Part Class: 扩展库; Supplier: LCSC
USB1 USB2 = TYPE-C 24P QT 143: 连接器类型:Type-C;标准:USB 3.1;公母:母;安装方式:卧贴;触点数量:24P;端口数量:1;额定电流 - 电源:5A;触头材质:-;触头镀层:-;工作温度范围:-30℃~+85℃;焊接温度(最大值):-;; LCSC Part Name: Type-C 母 卧贴; Supplier Part: C5156605; Manufacturer: SHOU HAN(首韩); Supplier Footprint: SMD; JLCPCB Part Class: 扩展库; Datasheet: https://atta.szlcsc.com/upload/public/pdf/source/20220831/D9AE5CFF2AD0EFBF4D20F10BBA9527F7.pdf; Supplier: LCSC; Connector Type: Type-C; Standard: USB 3.1; Gender: 母; Mounting Style: 卧贴; Number of Contacts: 24P; Number of Ports: 1; Current Rating - Power (Max): 5A; Operating Temperature Range: -30℃~+85℃; Connect-Disconnect Life: 1万次; Core Colour: 黑色
C103 C107 C161 = TAJB107M010RNJ: LCSC Part Name: 100uF ±20% 10V; Supplier Part: C7196; Manufacturer: Kyocera AVX; Supplier Footprint: CASE-B-3528; JLCPCB Part Class: Extended Part; Datasheet: https://atta.szlcsc.com/upload/public/pdf/source/20160107/1457707750344.pdf; Supplier: LCSC; Tolerance: ±20%; Rated Voltage: 10V; Equivalent Series Resistance(ESR): 1.4Ω@100kHz; Operating Temperature: -55℃~+125℃
D9-D11 = SJD12C06L01: LCSC Part Name: 双向ESD; Supplier Part: C313261; Manufacturer: Brightking(君耀电子); Supplier Footprint: SOD-123S; Datasheet: https://atta.szlcsc.com/upload/public/pdf/source/20190308/C313298_C5F5DA7B871929800C41255070D52D63.pdf; Supplier: LCSC; polarity: 双向; Reverse Stand-Off Voltage (Vrwm): 6V; Maximum Clamping Voltage: 10.3V; Peak Pulse Current (Ipp)@10/1000us: 19.4A; Breakdown Voltage: 6.67V; Type: ESD
LED1-LED3 = 19-217/BHC-ZL1M2RY/3T: LCSC Part Name: 蓝灯 停产; Supplier Part: C72041; Manufacturer: EVERLIGHT(亿光); Supplier Footprint: 0603; Datasheet: https://atta.szlcsc.com/upload/public/pdf/source/20170116/1484561237273.pdf; Supplier: LCSC; Emitted Color: 蓝色; Power Dissipation: 110mW; Forward Current: 5mA; Dominant Wavelength: 465nm~475nm; Peak Wavelength: 468nm; Lens Color: 无色透明透镜; Viewing Angle: 120°; Operating Temperature: -40℃~+85℃
U9 U10 U13 = AP2552W6-7: Supplier Part: C441824; Manufacturer: DIODES(美台); Supplier Footprint: SOT-26; Datasheet: https://atta.szlcsc.com/upload/public/pdf/source/20191127/C460354_4CFAF7D8FFF7BAFA7FC0211C66DD32F3.pdf; Supplier: LCSC; Number of Outputs: 1; Output Current: 2.1A; Input Voltage: 2.7V~5.5V; Resistor On-State: 70mΩ; Operating Temperature	-: -40℃~+125℃
USB4-USB6 = U231-091N-1BLRC19-F1: LCSC Part Name: Type-A 母; Supplier Part: C2880601; Manufacturer: XKB Connection(中国星坤); Supplier Footprint: 插件; JLCPCB Part Class: 扩展库; Datasheet: https://atta.szlcsc.com/upload/public/pdf/source/20211011/F9152B67DDACB3260630B500156A0B45.pdf; Supplier: LCSC; Connector Type: Type-A; Gender: 母; Number of Contacts: 9P; Number of Ports: 1; Current Rating - Power (Max): 1.8A; Contact Material: 铜合金; Contact Plating: 金; Operating Temperature Range: -40℃~+85℃; Soldering Temperature(Max): 235℃

## Nets
5V_USB1: C102.1 C103.1 LD2.1 U9.6(OUT)
5V_USB3: C107.1 C111.1 LD3.1 U10.6(OUT)
5V_USB4: C160.1 C161.1 LD4.1 U13.6(OUT)
AGND: C5.2 C8.1 C9.1 C10.2 C11.2 C12.2 C13.1 C14.1 C15.1 C16.2 C17.1 C18.2 C19.1 C20.1 C21.1 C22.2 C23.1 C24.1 C25.1 C26.1 C27.2 C28.2 C29.1 C30.1 C31.1 C32.2 C33.1 C34.2 C35.1 C39.1 C40.1 C42.1 C43.1 C44.1 C45.1 C47.1 C48.1 C49.1 C50.2 C51.2 C52.2 C72.1 C73.1 C74.1 C75.1 C76.1 C77.1 C78.1 C79.1 C80.1 C81.1 C82.1 C83.1 C84.1 C85.1 C86.1 C87.1 C88.1 C90.1 C91.1 C92.1 C93.1 C94.1 C96.1 C97.1 C98.1 C99.1 C100.1 C102.2 C103.2 C104.1 C107.2 C108.1 C109.1 C110.1 C111.2 C120.1 C121.1 C122.1 C123.1 C124.1 C125.1 C126.1 C127.2 C128.2 C130.1 C133.2 C135.2 C136.2 C137.2 C138.1 C139.1 C140.2 C141.2 C142.1 C143.1 C145.2 C146.2 C147.1 C148.1 C149.1 C150.1 C151.1 C154.1 C155.1 C158.1 C159.1 C160.2 C161.2 C162.1 C163.2 C164.2 C165.2 C166.2 C167.1 C168.1 C169.2 C170.2 C171.1 C172.1 C173.1 C174.1 D9.1 D10.1 D11.1 D12.1(K) D13.1(K) D14.1(K) DP1.3-8(GND) DP2.3-8(GND) DP3.3-8(GND) DP4.3-8(GND) DP5.3-8(GND) DP8.3 DP9.3 DP10.3 DP12.3-8(GND) DP13.3-8(GND) DP14.3-8(GND) DP17.3 DP18.3 DP19.3 HDMI1.2(TMDSData2Shield) HDMI1.5(TMDSData1Shield) HDMI1.8(TMDSData0Shield) HDMI1.11(TMDSClockShield) HDMI1.17(DDC/CECGround) HDMI1.20(EH) J1.3 LED1.1(C) LED2.1(C) LED3.1(C) LED4.1(K) Q3.2(S) Q4.2(S) Q5.2(S) Q6.2(S) R1.1 R3.1 R9.1 R10.1 R13.1 R16.1 R18.1 R21.1 R22.1 R25.1 R29.1 R30.2 R33.2 R36.2 R37.1 R48.2 R51.1 R52.2 R55.2 R58.2 R62.2 R66.1 R67.1 R68.1 R72.2 R74.2 R85.2 R89.2 R92.2 U1.8(GND) U1.14(GND) U1.22(TEST_EN) U1.63(GND) U1.69(EP) U3.2(PGND) U3.16(AGND) U5.2(GND) U6.2(GND) U7.40(VSSP) U7.77(EP) U8.2(GND) U9.2(GND) U10.2(GND) U11.29(GND) U11.41(EP) U12.4(GND) U13.2(GND) U14.4(GND) U15.29(GND) USB1.15(EP) USB1.16(EP) USB1.17(EP) USB1.18(EP) USB1.A1(GND) USB1.A12(GND) USB1.B1(GND) USB1.B12(GND) USB2.15(EP) USB2.16(EP) USB2.17(EP) USB2.18(EP) USB2.A1(GND) USB2.A12(GND) USB2.B1(GND) USB2.B12(GND) USB4.4(GND) USB4.7(GND_DRAIN) USB4.10(EH) USB4.11(EH) USB5.4(GND) USB5.7(GND_DRAIN) USB5.10(EH) USB5.11(EH) USB6.4(GND) USB6.7(GND_DRAIN) USB6.10(EH) USB6.11(EH) X1.2(GND) X1.4(GND) X2.2(GND) X2.4(GND)
AVDD1.2: C49.2 C72.2 C73.2 C74.2 C75.2 C76.2 C93.2 C94.2 L5.2 LD1.1 R49.1 U7.4(AVDD12) U7.7(VP12_P4) U7.17(VP12_P3) U7.22(VP12_P2) U7.39(FB) U7.60(VP12_P1) U7.70(VP12_P0)
DVDD1.2: C77.2 C78.2 C96.2 LD1.2 U7.28(DVDD12) U7.47(DVDD12)
PGND: RJ1.P10 RJ1.SHIELD0 RJ1.SHIELD1
VBUS_D_DIS: Q6.1(G) R37.2 U1.59(DOWN_DISCHARGE)
VBUS_D_EN: Q3.1(G) R9.2 U1.58(DOWN_VBUS_EN)
VBUS_DFP: C163.1 C164.1 D12.2(A) D15.2(A) Q1.5(D) Q1.6(D) Q1.7(D) Q1.8(D) Q1.9(D) R11.2 R17.2 USB2.A4(VBUS) USB2.A9(VBUS) USB2.B4(VBUS) USB2.B9(VBUS)
VBUS_FB_D: C169.1 R17.1 R18.2 U1.66(VBUS_MON_D)
VBUS_FB_U: C170.1 R15.1 R16.2 U1.67(VBUS_MON_U)
VBUS_HUB: C24.2 C25.2 C26.2 C33.2 C52.1 D14.2(A) D15.1(K) D16.1(K) Q1.1(S) Q1.2(S) Q1.3(S) Q2.1(S) Q2.2(S) Q2.3(S) R6.1 R7.1 R23.2 R24.2 U3.3(VIN)
VBUS_IN: C97.2 R50.1 R51.2 U7.54(VBUS)
VBUS_U_DIS: Q5.1(G) R13.2 U1.61(UP_DISCHARGE)
VBUS_U_EN: Q4.1(G) R10.2 U1.60(UP_VBUS_EN)
VBUS_UFP: C165.1 C166.1 D13.2(A) D16.2(A) Q2.5(D) Q2.6(D) Q2.7(D) Q2.8(D) Q2.9(D) R12.2 R15.2 USB1.A4(VBUS) USB1.A9(VBUS) USB1.B4(VBUS) USB1.B9(VBUS)
VDD1.0: C5.1 C11.1 C16.1 C17.2 C18.1 C19.2 C22.1 C27.1 C41.2 C42.2 C43.2 C120.2 L3.2 R32.2 R76.1 U1.5(RX_AVDD10) U1.17(RX_AVDD10) U1.21(VDD10) U1.42(VDD10) U1.43(AVDD10_TX) U1.52(AVDD10_TX) U1.53(AVDD10_PLL) U1.62(VDD10)
VDD1.2: C89.2 C90.2 C91.2 L4.2 R47.2 R49.2
VDD1.8: C50.1 C51.1 U1.11(RX_AVDD18)
VDD3.3: C10.1 C12.1 C13.2 C20.2 C21.2 C46.2 C47.2 C48.2 C154.2 C155.2 C167.2 C168.2 C171.2 C172.2 C173.2 L2.2 R2.2 R35.2 R43.2 R56.1 R57.2 R60.1 R61.2 R78.1 R83.1 R84.2 R91.2 U1.4(RX_AVDD33) U1.18(RX_AVDD33) U1.37(AVDD33) U1.54(AVDD33_PLL) U1.55(AVDD33_IO) U12.3(WP#(IO2)) U12.7(HOLD# or RESET#(IO3)) U12.8(VCC) U14.3(WP#(IO2)) U14.7(HOLD# or RESET#(IO3)) U14.8(VCC) U15.22(VCC)
VDD5.0: C14.2 C15.2 C29.2 C30.2 C31.2 C32.1 C34.1 C38.2 C39.2 C40.2 C44.2 C45.2 C87.2 C88.2 C99.2 C100.2 C109.2 C110.2 C136.1 C137.1 C145.1 C158.2 C159.2 D1.2(A) R19.2 R20.2 R27.1 R28.1 R31.1 R34.1 R45.2 R46.1 R50.2 R88.2 U1.32(VDD5_IN) U1.33(VDD5_IN) U3.20(CSN) U5.4(VIN) U6.4(VIN) U8.4(VIN) U9.1(IN) U10.1(IN) U11.21(VDD5) U11.27(VDDREG5) U13.1(IN)
VDDB3.3: C79.2 C80.2 C81.2 C82.2 C83.2 C84.2 C92.2 R43.1 R44.2 R53.2 R54.1 R87.1 U7.12(AVDD33_2) U7.27(AVDD33_3) U7.44(V33) U7.55(DVDD33) U7.65(AVDD33_1) U7.73(AVDD33)
VDDC1.0: C123.2 C124.2 C125.2 C126.2 C127.1 C128.1 C138.2 C139.2 C147.2 C148.2 L6.2 R75.2 R76.2 U11.3(AVDD10) U11.8(AVDD10) U11.14(U3VDD10) U11.19(U2VDD10) U11.34(DVDD10) U11.37(AVDD10)
VDDC3.3: C130.2 C133.1 C135.1 C140.1 C141.1 C142.2 C143.2 C146.1 R73.2 R77.2 R78.2 R79.2 R80.2 U11.11(AVDD33) U11.23(DVDD33) U11.26(VDDREG33) U11.33(DVDD33) U11.39(AVDD33) U11.40(AVDD33)
AMSEL: R89.1 U15.8(AMSEL)
AUX_N_UFP: C7.2 U1.2(AUX_N)
AUX_P_UFP: C6.2 U1.3(AUX_P)
BB_DN: R70.2 U1.20(BB_DM)
BB_DP: R69.2 U1.19(BB_DP)
CC1_DFP: DP17.2 U1.64(DFP_CC1) USB2.A5(CC1)
CC1_UFP: C8.2 DP19.1 U1.1(UFP_CC1) USB1.B5(CC2)
CC2_DFP: DP17.1 U1.65(DFP_CC2) USB2.B5(CC2)
CC2_UFP: C9.2 R4.2 U1.68(UFP_CC2)
CH_RXN1: U7.71(RXN1_P0) U15.27(SSRX_N)
CH_RXP1: U7.72(RXP1_P0) U15.28(SSRX_P)
CH_TXN1: U7.68(TXN1_P0) U15.25(SSTX_N)
CH_TXP1: U7.69(TXP1_P0) U15.26(SSTX_P)
CHAUX_N: C7.1 R3.2 U15.13(SBU1)
CHAUX_P: C6.1 R2.1 U15.14(SBU2)
CSO: R22.2 U3.19(CSO)
CSP: C28.1 R19.1 U3.1(VOUT) U3.21(CSP)
DCDC1.0: L6.1 U11.28(REGOUT)
DM1: DP8.1 U7.64(DM_P1) USB4.2(D-)
DM2: U7.26(DM_P2) U11.17(U2DM)
DM3: DP9.1 U7.14(DM_P3) USB5.2(D-)
DM4: DP10.1 U7.11(DM_P4) USB6.2(D-)
DN_DFP: DP18.1 R70.1 USB2.A7(DN1) USB2.B7(DN2)
DN_UFP: DP14.4 DP14.7 U7.67(DM_P0) USB1.A7(DN1) USB1.B7(DN2)
DP1: DP8.2 U7.63(DP_P1) USB4.3(D+)
DP2: U7.25(DP_P2) U11.18(U2DP)
DP3: DP9.2 U7.13(DP_P3) USB5.3(D+)
DP4: DP10.2 U7.10(DP_P4) USB6.3(D+)
DP_DFP: DP18.2 R69.1 USB2.A6(DP1) USB2.B6(DP2)
DP_UFP: DP14.5 DP14.6 U7.66(DP_P0) USB1.A6(DP1) USB1.B6(DP2)
ENSWREG: R73.1 R74.1 U11.25(EEDI/SPISDI/ENSWREG) U12.5(DI(IO0))
G_LED1: R59.1 U7.74(PGREEN_P1)
G_LED3: R63.1 U7.2(PGREEN_P3)
G_LED4: R86.1 U7.76(PGREEN_P4)
HDI0_N: RJ1.P3(MDI0-) U11.2(MDIN0)
HDI0_P: RJ1.P2(MDI0+) U11.1(MDIP0)
HDI1_N: RJ1.P7(MDI1-) U11.5(MDIN1)
HDI1_P: RJ1.P4(MDI1+) U11.4(MDIP1)
HDI2_N: RJ1.P6(MDI2-) U11.7(MDIN2)
HDI2_P: RJ1.P5(MDI2+) U11.6(MDIP2)
HDI3_N: RJ1.P9(MDI3-) U11.10(MDIN3)
HDI3_P: RJ1.P8(MDI3+) U11.9(MDIP3)
HDMI_5V: D1.1(K) HDMI1.18(+5VPower) R64.1 R65.1
HDMI_CKN: DP5.5 DP5.6 HDMI1.12(TMDSClock-) U1.44(HDMI_CKN)
HDMI_CKP: DP5.4 DP5.7 HDMI1.10(TMDSClock+) U1.45(HDMI_CKP)
HDMI_D0N: DP5.2 DP5.9 HDMI1.9(TMDSData0-) U1.46(HDMI_D0N)
HDMI_D0P: DP5.1 DP5.10 HDMI1.7(TMDSData0+) U1.47(HDMI_D0P)
HDMI_D1N: DP4.5 DP4.6 HDMI1.6(TMDSData1-) U1.48(HDMI_D1P)
HDMI_D1P: DP4.4 DP4.7 HDMI1.4(TMDSData1+) U1.49(HDMI_D1P)
HDMI_D2N: DP4.2 DP4.9 HDMI1.3(TMDSData2-) U1.50(HDMI_D2N)
HDMI_D2P: DP4.1 DP4.10 HDMI1.1(TMDSData2+) U1.51(HDMI_D2P)
HDMI_HPD: HDMI1.19(HotPlugDetect) U1.38(HDMI_HPD)
HDMI_SCL: HDMI1.15(SCL) R64.2 U1.40(HDMI_SCL)
HDMI_SDA: HDMI1.16(SDA) R65.2 U1.39(HDMI_SDA)
HUB_VBUS: C85.2 C86.2 R44.1 R45.1 U7.42(VDDP) U7.43(V5)
LANE0_N: U1.7(LANE0_N) U15.20(LNC_N)
LANE0_P: U1.6(LANE0_P) U15.21(LNC_P)
LANE1_N: U1.10(LANE1_N) U15.23(LND_N)
LANE1_P: U1.9(LANE1_P) U15.24(LND_P)
LDO1.0: R75.1 U11.22(DVDD10_UPS)
LDO3.3: R77.1 U11.20(AVDD33)
LED0: RJ1.13 U11.32(LED0/SPICSB) U12.1(CS#)
LED2: RJ1.12 U11.24(EEDO/LED2/SPISDO/LANWAKEB/GPIO) U12.2(DO(IO1))
POL: R66.2 U1.23(GPIO5) U15.3(POL)
REST: R72.1 U11.38(RSET)
RSET: C98.2 R53.1 U7.48(RESETJ)
RXN1_UFP: DP12.4 DP12.7 U15.2(RX1_N) USB1.A10(SSRXn2)
RXN2_UFP: DP13.1 DP13.10 U15.10(RX2_N) USB1.B10(SSRXn1)
RXP1_UFP: DP12.5 DP12.6 U15.1(RX1_P) USB1.A11(SSRXp2)
RXP2_UFP: DP13.2 DP13.9 U15.9(RX2_P) USB1.B11(SSRXp1)
SBU1: U15.11(CSBU1) USB1.B8(SUB2)
SBU2: U15.12(CSBU2) USB1.A8(SUB1)
SCL: J1.2 R28.2 U3.6(SCL)
SDA: J1.1 R27.2 U3.5(SDA)
SPISCK: U11.30(EESK/LED1/SPISCK) U12.6(CLK)
TXN1_UFP: C3.1 DP12.1 DP12.10 USB1.B3(SSTXn2)
TXN2_UFP: C1.1 DP13.4 DP13.7 USB1.A3(SSTXn1)
TXP1_UFP: C4.1 DP12.2 DP12.9 USB1.B2(SSTXp2)
TXP2_UFP: C2.1 DP13.5 DP13.6 USB1.A2(SSTXP1)
U1_TXN: C106.1 U7.58(TXN1_P1)
U1_TXP: C105.1 U7.59(TXP1_P1)
U2_TXN: C113.1 U7.20(TXN1_P2)
U2_TXP: C112.1 U7.21(TXP1_P2)
U3_TXN: C157.1 U7.15(TXN1_P3)
U3_TXP: C156.1 U7.16(TXP1_P3)
U4_TXN: C153.1 U7.5(TXN1_P4)
U4_TXP: C152.1 U7.6(TXP1_P4)
U7_CK: U7.50(P_SPI_CK) U14.6(CLK)
U7_CZ: U7.52(P_SPI_CZ) U14.1(CS#)
U7_DI: U7.51(P_SPI_DI) U14.5(DI(IO0))
U7_DO: U7.49(P_SPI_DO) U14.2(DO(IO1))
UPCC2: DP19.2 R1.2 R4.1 USB1.A5(CC1)
USB1_RXN: DP1.2 DP1.9 U7.61(RXN1_P1) USB4.6(StdA_SSRX+)
USB1_RXP: DP1.1 DP1.10 U7.62(RXP1_P1) USB4.5(StdA_SSRX-)
USB1_TXN: C106.2 DP1.5 DP1.6 USB4.9(StdA_SSTX+)
USB1_TXP: C105.2 DP1.4 DP1.7 USB4.8(StdA_SSTX-)
USB2_RXN: U7.23(RXN1_P2) U11.16(U3SSRXP)
USB2_RXP: U7.24(RXP1_P2) U11.15(U3SSRXN)
USB2_TXN: C113.2 U11.13(U3SSTXP)
USB2_TXP: C112.2 U11.12(U3SSTXN)
USB3_RXN: DP2.2 DP2.9 U7.18(RXN1_P3) USB5.6(StdA_SSRX+)
USB3_RXP: DP2.1 DP2.10 U7.19(RXP1_P3) USB5.5(StdA_SSRX-)
USB3_TXN: C157.2 DP2.5 DP2.6 USB5.9(StdA_SSTX+)
USB3_TXP: C156.2 DP2.4 DP2.7 USB5.8(StdA_SSTX-)
USB4_RXN: DP3.2 DP3.9 U7.8(RXN1_P4) USB6.5(StdA_SSRX-)
USB4_RXP: DP3.1 DP3.10 U7.9(RXP1_P4) USB6.6(StdA_SSRX+)
USB4_TXN: C153.2 DP3.5 DP3.6 USB6.9(StdA_SSTX+)
USB4_TXP: C152.2 DP3.4 DP3.7 USB6.8(StdA_SSTX-)
USB_EN1: R56.2 U7.37(PWREN1J) U9.3(EN/EN#)
USB_EN3: R60.2 U7.33(PWREN3J) U10.3(EN/EN#)
USB_EN4: R83.2 U7.32(PWREN4J) U13.3(EN/EN#)
USB_OC1: R57.1 U7.38(OVCUR1J) U9.4(FAULT#)
USB_OC2: R87.2 U7.35(OVCUR2J)
USB_OC3: R61.1 U7.34(OVCUR3J/SMC) U10.4(FAULT#)
USB_OC4: R84.1 U7.31(OVCUR4J/SMD) U13.4(FAULT#)
VIC_5V: C23.2 U3.9(VCC)
X1: C121.2 R82.1 U7.57(X1) X1.1(OSC1)
X2: C122.2 R82.2 U7.56(X2) X1.3(OSC2)
XL1: C149.2 R81.1 U11.35(CKXTAL1) X2.1(OSC1)
XL2: C150.2 R81.2 U11.36(CKXTAL2) X2.3(OSC2)
$1N9521: C1.2 U15.7(TX2_N)
$1N9525: C2.2 U15.6(TX2_P)
$1N9529: C4.2 U15.4(TX1_P)
$1N9533: C3.2 U15.5(TX1_N)
$1N9878: R91.1 R92.1 U15.17(EN)
$1N11239: R67.2 U1.24(GPIO6)
$1N11243: R68.2 U1.25(GPIO7)
$1N14902: R55.1 U7.53(PGANG)
$1N15021: R52.1 U7.46(RTERM)
$1N15025: R54.2 U7.45(CHIPEN)
$1N15288: L5.1 U7.41(SW)
$1N17796: Q1.4(G) R5.2 R6.2
$1N17804: Q3.3(D) R5.1
$1N17957: Q2.4(G) R7.2 R8.2
$1N18011: Q4.3(D) R8.1
$1N18511: Q6.3(D) R11.1
$1N22182: Q5.3(D) R12.1
$2N692: C37.2 U3.11(BT1)
$2N696: C37.1 L1.1 R29.2 U3.12(SW1)
$2N734: C36.1 L1.2 R30.1 U3.13(SW2)
$2N1107: R26.1 U3.17(COMP)
$2N1112: C38.1 R20.1 R21.2 U3.18(FB)
$2N1453: R24.1 R25.2 U3.8(VSET)
$2N1996: C174.2 R23.1 U3.4(CE)
$2N3008: LED4.2(A) R88.1
$2N6559: L2.1 U6.3(SW)
$2N6587: C46.1 R35.1 R36.1 U6.5(FB)
$2N6866: R34.2 U6.1(EN)
$2N7336: L4.1 U8.3(SW)
$2N7338: C89.1 R47.1 R48.1 U8.5(FB)
$2N7349: R46.2 U8.1(EN)
$2N9602: L3.1 U5.3(SW)
$2N9604: C41.1 R32.1 R33.1 U5.5(FB)
$2N9615: R31.2 U5.1(EN)
$2N14141: C35.2 R26.2
$2N20882: C36.2 U3.14(BT2)
$3N616: R58.1 U9.5(ILIM)
$3N1225: C104.2 D9.2 LD2.2 USB4.1(VBUS)
$3N1723: C108.2 D10.2 LD3.2 USB5.1(VBUS)
$3N2005: C162.2 D11.2 LD4.2 USB6.1(VBUS)
$3N3418: LED1.2(A) R59.2
$3N3836: R62.1 U10.5(ILIM)
$3N3838: LED2.2(A) R63.2
$3N4240: R85.1 U13.5(ILIM)
$3N4242: LED3.2(A) R86.2
$4N3390: C151.2 RJ1.P1
$4N3471: R80.1 RJ1.11
$4N3497: R79.1 RJ1.14

Not connected (* = marked no-connect by the designer): DP14 1 2 9 10; HDMI1 13(CEC)* 14(Reserved(N.C.))*; U1 12(NC)* 13(NC)* 15(NC)* 16(NC)* 26(NC)* 27(NC)* 28(NC)* 29(NC)* 30(VDD33_OUT)* 31(VDD33_OUT)* 34(NC)* 35(NC)* 36(NC)* 41(HDMI_CEC)* 56(CFG_SCL)* 57(CFG_SDA)*; U3 7(NC)* 10(NC)* 15(NC)*; U7 1(PAMBER_P4)* 3(PAMBER_P3)* 29(PGREEN_P2)* 30(PAMBER_P2)* 36(PWREN2J)* 75(PAMBER_P1)*; U11 31(EECS)*; U15 15(LNA_N) 16(LNA_P) 18(LNB_N) 19(LNB_P); USB2 A2(SSTXP1)* A3(SSTXn1)* A8(SUB1)* A10(SSRXn2)* A11(SSRXp2)* B2(SSTXp2)* B3(SSTXn2)* B8(SUB2)* B10(SSRXn1)* B11(SSRXp1)*
